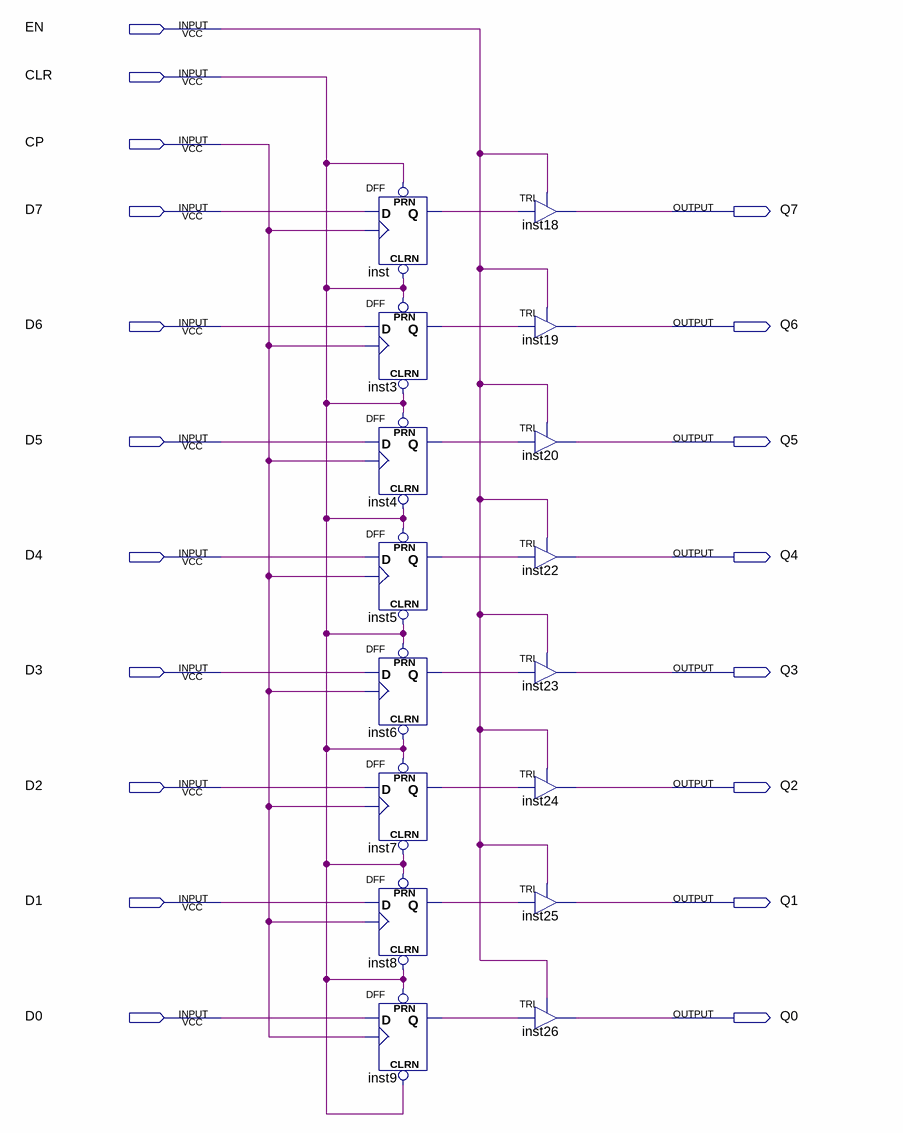
[diagram p0: schematic sheet]
// Quartus schematic MBR.bdf as structural Verilog: 16 symbols, 19 pins
module MBR (
  input  EN,
  input  CLR,
  input  CP,
  input  D7,
  input  D6,
  input  D5,
  input  D4,
  input  D3,
  input  D2,
  input  D1,
  input  D0,
  output Q7,
  output Q6,
  output Q5,
  output Q4,
  output Q3,
  output Q2,
  output Q1,
  output Q0
);

  wire inst3_q, inst4_q, inst5_q, inst6_q, inst7_q, inst8_q, inst9_q, inst_q;

  DFF inst (.CLRN(CLR), .CLK(CP), .D(D7), .PRN(CLR), .Q(inst_q));
  DFF inst3 (.CLRN(CLR), .CLK(CP), .D(D6), .PRN(CLR), .Q(inst3_q));
  DFF inst4 (.CLRN(CLR), .CLK(CP), .D(D5), .PRN(CLR), .Q(inst4_q));
  DFF inst5 (.CLRN(CLR), .CLK(CP), .D(D4), .PRN(CLR), .Q(inst5_q));
  DFF inst6 (.CLRN(CLR), .CLK(CP), .D(D3), .PRN(CLR), .Q(inst6_q));
  DFF inst7 (.CLRN(CLR), .CLK(CP), .D(D2), .PRN(CLR), .Q(inst7_q));
  DFF inst8 (.CLRN(CLR), .CLK(CP), .D(D1), .PRN(CLR), .Q(inst8_q));
  DFF inst9 (.CLRN(CLR), .CLK(CP), .D(D0), .PRN(CLR), .Q(inst9_q));
  TRI inst18 (.IN(inst_q), .OE(EN), .OUT(Q7));
  TRI inst19 (.IN(inst3_q), .OE(EN), .OUT(Q6));
  TRI inst20 (.IN(inst4_q), .OE(EN), .OUT(Q5));
  TRI inst22 (.IN(inst5_q), .OE(EN), .OUT(Q4));
  TRI inst23 (.IN(inst6_q), .OE(EN), .OUT(Q3));
  TRI inst24 (.IN(inst7_q), .OE(EN), .OUT(Q2));
  TRI inst25 (.IN(inst8_q), .OE(EN), .OUT(Q1));
  TRI inst26 (.IN(inst9_q), .OE(EN), .OUT(Q0));
endmodule
